# EAGLE design x-OSC Gloves_v6 (EAGLE 6.4)
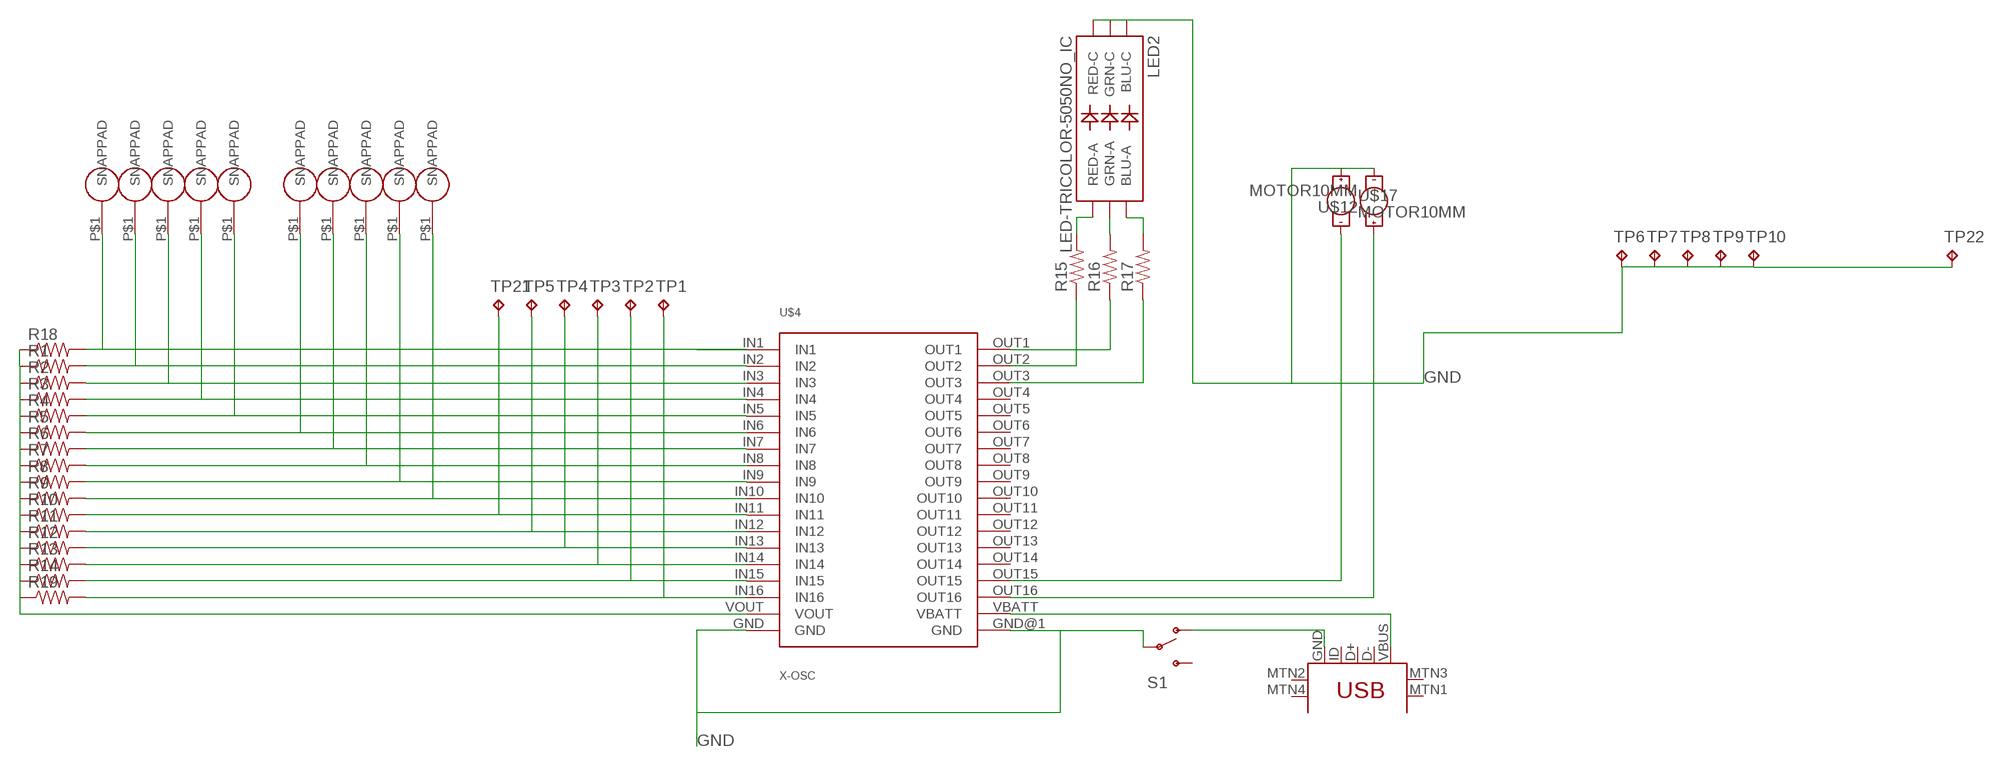
[diagram p0: schematic, sheet 1]

## Parts
LED2  LED-TRICOLOR-5050NO_IC  [LED-TRICOLOR-5050]
R1  RESISTOR0805-RES  [0805]
R2  RESISTOR0805-RES  [0805]
R3  RESISTOR0805-RES  [0805]
R4  RESISTOR0805-RES  [0805]
R5  RESISTOR0805-RES  [0805]
R6  RESISTOR0805-RES  [0805]
R7  RESISTOR0805-RES  [0805]
R8  RESISTOR0805-RES  [0805]
R9  RESISTOR0805-RES  [0805]
R10  RESISTOR0805-RES  [0805]
R11  RESISTOR0805-RES  [0805]
R12  RESISTOR0805-RES  [0805]
R13  RESISTOR0805-RES  [0805]
R14  RESISTOR0805-RES  [0805]
R15  RESISTOR0805-RES  [0805]
R16  RESISTOR0805-RES  [0805]
R17  RESISTOR0805-RES  [0805]
R18  RESISTOR0805-RES  [0805]
R19  RESISTOR0805-RES  [0805]
S1  SWITCH-SPDT-SMD-A  [SWITCH-SPST-SMD-A]
TP1  TPTP20R  [TP20R]
TP2  TPTP20R  [TP20R]
TP3  TPTP20R  [TP20R]
TP4  TPTP20R  [TP20R]
TP5  TPTP20R  [TP20R]
TP6  TPTP20R  [TP20R]
TP7  TPTP20R  [TP20R]
TP8  TPTP20R  [TP20R]
TP9  TPTP20R  [TP20R]
TP10  TPTP20R  [TP20R]
TP21  TPTP20R  [TP20R]
TP22  TPTP20R  [TP20R]
U$1  SNAP-PAD_7MM_ROUND  [SNAP-PAD_7MM_RD]
U$2  SNAP-PAD_7MM_ROUND  [SNAP-PAD_7MM_RD]
U$3  SNAP-PAD_7MM_ROUND  [SNAP-PAD_7MM_RD]
U$4  X-OSC  [X-OSC_SMD]
U$5  USB-MINIB-5PIN  [USB-MINIB]
U$6  SNAP-PAD_7MM_ROUND  [SNAP-PAD_7MM_RD]
U$7  SNAP-PAD_7MM_ROUND  [SNAP-PAD_7MM_RD]
U$8  SNAP-PAD_7MM_ROUND  [SNAP-PAD_7MM_RD]
U$9  SNAP-PAD_7MM_ROUND  [SNAP-PAD_7MM_RD]
U$10  SNAP-PAD_7MM_ROUND  [SNAP-PAD_7MM_RD]
U$11  SNAP-PAD_7MM_ROUND  [SNAP-PAD_7MM_RD]
U$12  MOTOR10MM  [VIBE-MOTOR-10MM]
U$17  MOTOR10MM  [VIBE-MOTOR-10MM]
U$21  SNAP-PAD_7MM_ROUND  [SNAP-PAD_7MM_RD]

## Nets
GND: LED2.4(BLU-C) LED2.5(RED-C) LED2.6(GRN-C) S1.2(P) TP6.TP TP7.TP TP8.TP TP9.TP TP10.TP TP22.TP U$4.GND U$4.GND@1(GND) U$12.- U$17.+
N$1: LED2.1(GRN-A) R16.2
N$2: LED2.2(RED-A) R15.2
N$3: R15.1 U$4.OUT2
N$4: R1.2 U$1.P$1(SNAPPAD) U$4.IN2
N$5: R16.1 U$4.OUT1
N$6: R2.2 U$2.P$1(SNAPPAD) U$4.IN3
N$7: R3.2 U$3.P$1(SNAPPAD) U$4.IN4
N$8: R4.2 U$4.IN5 U$6.P$1(SNAPPAD)
N$9: R5.2 U$4.IN6 U$7.P$1(SNAPPAD)
N$12: R6.2 U$4.IN7 U$8.P$1(SNAPPAD)
N$13: R7.2 U$4.IN8 U$9.P$1(SNAPPAD)
N$14: R8.2 U$4.IN9 U$10.P$1(SNAPPAD)
N$15: R9.2 U$4.IN10 U$11.P$1(SNAPPAD)
N$16: R10.2 TP21.TP U$4.IN11
N$17: LED2.3(BLU-A) R17.2
N$18: R11.2 TP5.TP U$4.IN12
N$19: R12.2 TP4.TP U$4.IN13
N$20: R13.2 TP3.TP U$4.IN14
N$21: R14.2 TP2.TP U$4.IN15
N$22: R19.2 TP1.TP U$4.IN16
N$23: U$4.OUT15 U$17.-
N$24: U$4.OUT16 U$12.+
N$25: R17.1 U$4.OUT3
N$26: S1.1(O) U$5.GND
N$33: U$4.VBATT U$5.VBUS
N$40: R18.2 U$4.IN1 U$21.P$1(SNAPPAD)
VDD: R1.1 R2.1 R3.1 R4.1 R5.1 R6.1 R7.1 R8.1 R9.1 R10.1 R11.1 R12.1 R13.1 R14.1 R18.1 R19.1 U$4.VOUT
Unconnected: S1.3(S) U$4.OUT4 U$4.OUT5 U$4.OUT6 U$4.OUT7 U$4.OUT8 U$4.OUT9 U$4.OUT10 U$4.OUT11 U$4.OUT12 U$4.OUT13 U$4.OUT14 U$5.D+ U$5.D- U$5.ID U$5.MTN1(MTN2) U$5.MTN2(MTN3) U$5.MTN3(MTN1) U$5.MTN4

## Library data of the parts
LED2 = SparkFun-LED:LED-TRICOLOR-5050
R1-R19 = SparkFun-Passives:RESISTOR: Resistor Basic schematic elements and footprints for 0603, 1206, and PTH resistors.
S1 = SparkFun-Electromechanical:SWITCH-SPDT: SPDT Switch Simple slide switch, Spark Fun Electronics SKU : COM-00102 DPDT SMT slide switch, AYZ0202, SWCH-08179
TP1-TP10 TP21 TP22 = testpad:TP: Test pad
U$1-U$3 U$6-U$11 U$21 = hannahsEagleLib:SNAP-PAD_7MM_ROUND
U$4 = x-io:X-OSC: 2x "TSM-118-04-F-SV" See: http://www.toby.co.uk/content/catalogue/products.aspx?series=TSM-1xx-xx-SV
U$5 = SparkFun-Connectors:USB-MINIB: Mini-USB "B" connector with 5th pin broken out. Created new symbol breaking out 5th "ID" pin in mini/micro USB connector spec. See: http://en.wikipedia.org/wiki/Mini_usb#Cables. Uses same footprint as 4-pin symbol. Also added pins to connect to mounting / shield pads if required (probably not generally needed as signals aren't shielded once they leave the connector).
U$12 U$17 = SparkFun-Electromechanical:MOTOR: Vibration Motor- ROB-08449 Physical dimension and wire connections for this powerful vibration motor. Motor has a self adhesive backing.

## Board
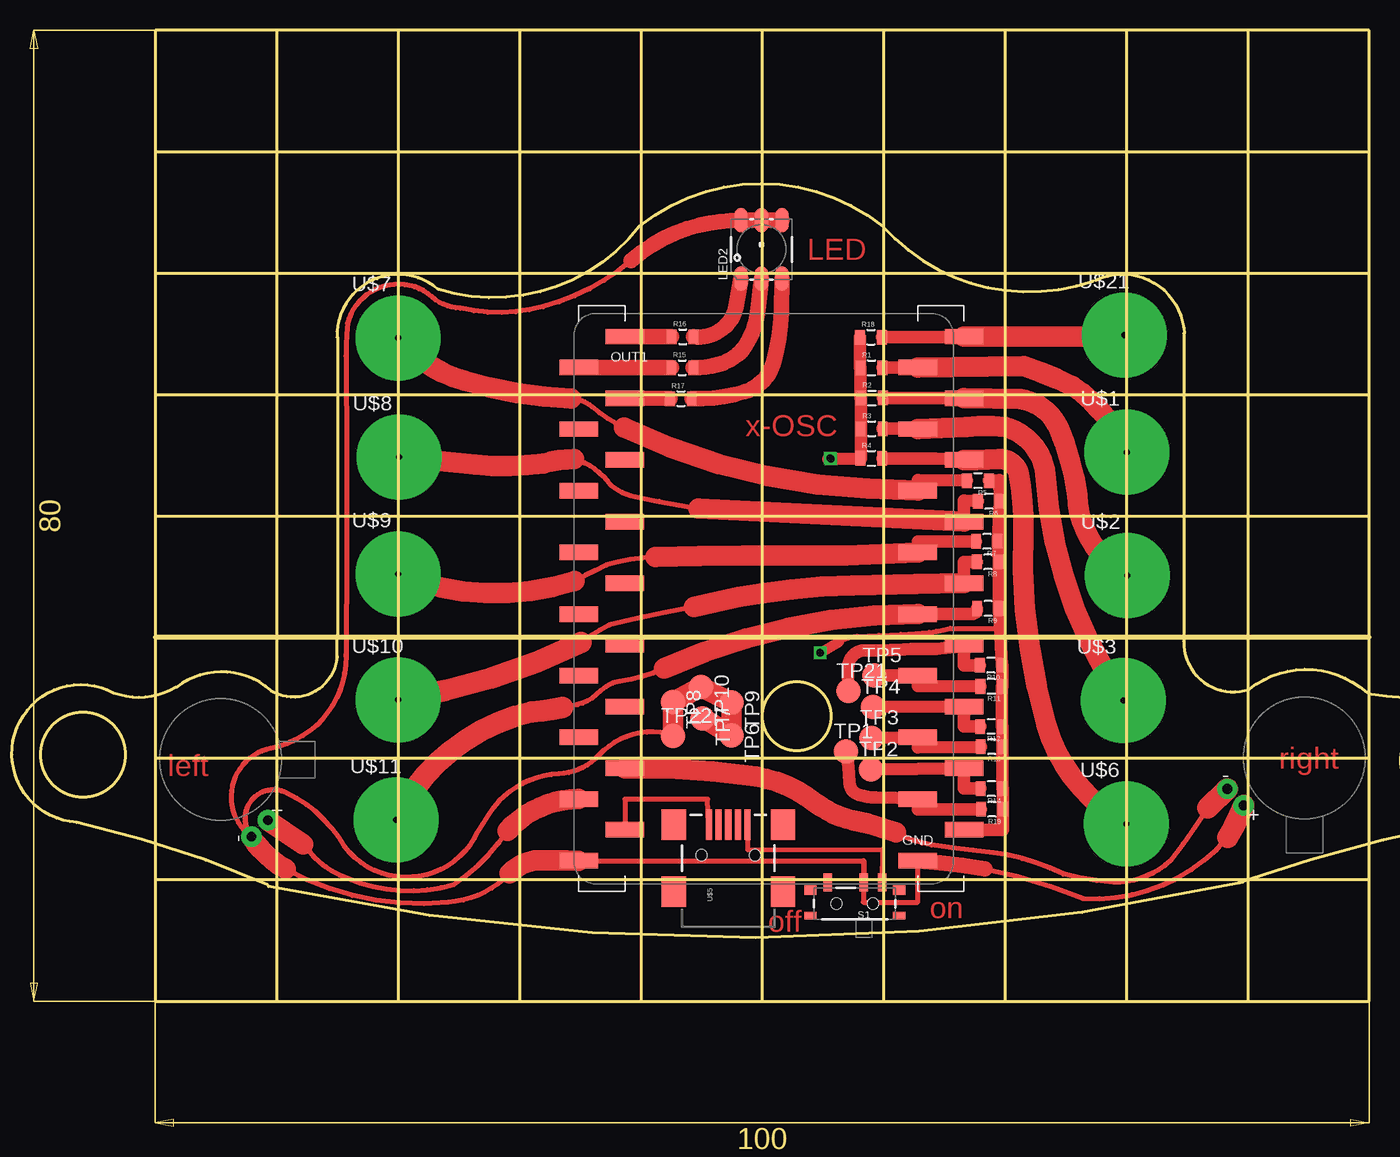
[diagram p1: board, top side]
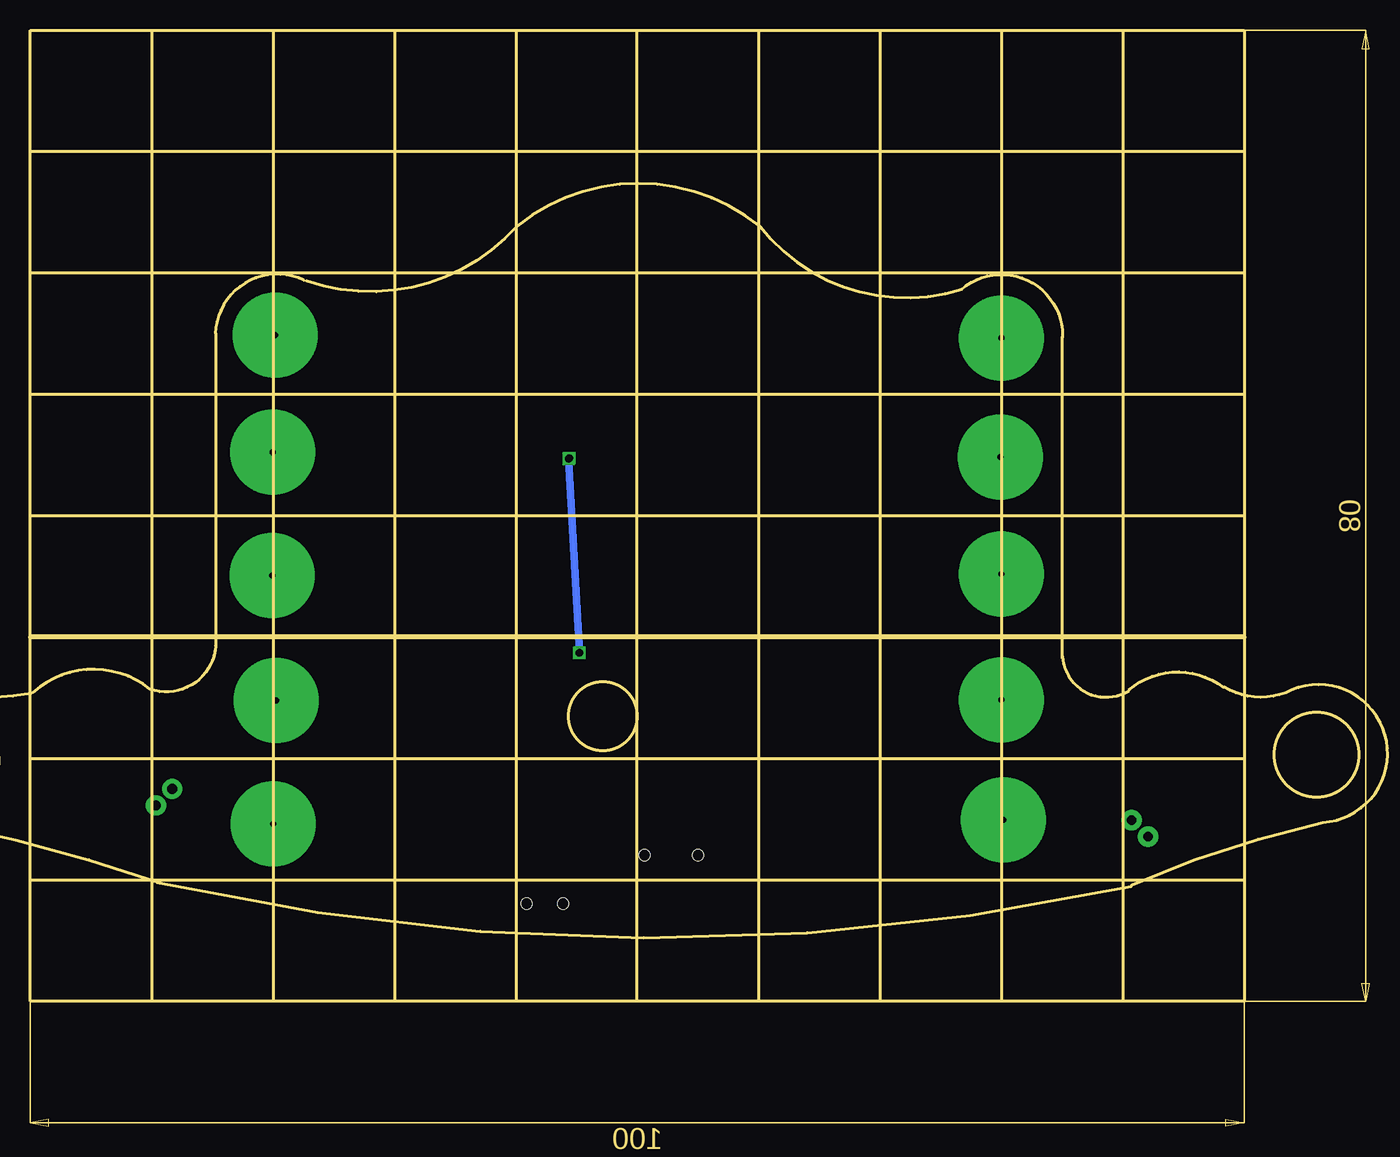
[diagram p2: board, bottom side, seen from below]

Size 100 x 80 mm. Coordinates in mm from the lower left corner, seen from the top.
Outline: 50,0 50,80
Outline: 40,80 40,0
Outline: 30,80 30,0
Outline: 20,80 20,0
Outline: 10,80 10,0
Outline: 0,70 0,80 60,80
Outline: 0,70 0,60
Outline: 0,60 0,50
Outline: 0,50 0,40
Outline: 0,40 0,30
Outline: 0,30 0,20
Outline: 0,20 0,10
Outline: 0,10 0,0 60,0
Outline: 60,0 70,0
Outline: 70,0 80,0
Outline: 80,0 90,0
Outline: 90,0 100,0 100,10
Outline: 100,10 100,20
Outline: 100,20 100,30
Outline: 100,30 100,40
Outline: 100,40 100,50
Outline: 100,50 100,60
Outline: 100,60 100,70
Outline: 100,70 100,80 90,80
Outline: 90,80 80,80
Outline: 80,80 70,80
Outline: 70,80 60,80
Outline: 60,80 60,0
Outline: 70,80 70,0
Outline: 80,80 80,0
Outline: 90,80 90,0
Outline: 100,10 0,10
Outline: 0,60 100,60
Outline: 0,50 100,50
Outline: 0,40 100,40
Outline: 0,30 100,30
Outline: 100,20 0,20
Outline: 0,70 100,70
Copper layers (1*16): Top 0.035mm / dielectric 1.5mm / Bottom 0.035mm
Design rules "default": minimum track width 10mil, minimum drill 24mil, track to track 8mil, track to pad 8mil, pad to pad 8mil, via to via 8mil, smd to smd 8mil, copper to edge 40mil, drill to drill 8mil, minimum pad ring 10mil, minimum via ring 8mil, stop-mask expansion 4mil, vias tented up to drill 0mil, thermal gap 10mil
Milling: area -9.5,16.8 to -2.5,23.8; area 102.6,16.3 to 109.6,23.3; area 50,20.7 to 55.6,26.3; 20 lines

### Footprints (pad centres in the part's own frame; a part is rotated, then mirrored left to right if it is on the bottom)
LED-TRICOLOR-5050 = smd 2 x 1.1: 1 -2.4,1.7; 2 -2.4,0; 3 -2.4,-1.7; 4 2.4,-1.7; 5 2.4,0; 6 2.4,1.7
0805 = smd 0.8 x 1.2: 1 -0.9,0; 2 0.9,0
SWITCH-SPST-SMD-A = smd 0.7 x 1.5: 1 -2.25,-1.75; 2 -0.75,-1.75; 3 2.25,-1.75 | smd 1 x 0.6: GND1 -3.65,1; GND3 3.65,1 | smd 1 x 0.8: GND2 -3.65,-1.1; GND4 3.65,-1.1 | hole 0.9: -1.5,0; 1.5,0
TP20R = smd 2 x 2: TP 0,0
SNAP-PAD_7MM_RD = drill 0.5 pad 7: P$1 0,0
X-OSC_SMD = smd 3.17 x 1.27: GND 12.7,-21.59; GND@1 -15.24,-21.59; IN1 16.51,21.59; IN2 12.7,19.05; IN3 16.51,16.51; IN4 12.7,13.97; IN5 16.51,11.43; IN6 12.7,8.89; IN7 16.51,6.35; IN8 12.7,3.81; IN9 16.51,1.27; IN10 12.7,-1.27; IN11 16.51,-3.81; IN12 12.7,-6.35; IN13 16.51,-8.89; IN14 12.7,-11.43; IN15 16.51,-13.97; IN16 12.7,-16.51; OUT1 -11.43,21.59; OUT2 -15.24,19.05; OUT3 -11.43,16.51; OUT4 -15.24,13.97; OUT5 -11.43,11.43; OUT6 -15.24,8.89; OUT7 -11.43,6.35; OUT8 -15.24,3.81; OUT9 -11.43,1.27; OUT10 -15.24,-1.27; OUT11 -11.43,-3.81; OUT12 -15.24,-6.35; OUT13 -11.43,-8.89; OUT14 -15.24,-11.43; OUT15 -11.43,-13.97; OUT16 -15.24,-16.51; VBATT -11.43,-19.05; VOUT 16.51,-19.05
USB-MINIB = smd 2.5 x 0.5: D+ 2.5,0; D- 2.5,0.8; GND 2.5,-1.6; ID 2.5,-0.8; VBUS 2.5,1.6 | smd 2.5 x 2: MTN1 -3,4.5; MTN2 2.5,4.5; MTN3 -3,-4.5; MTN4 2.5,-4.5 | hole 0.9: 0,2.2; 0,-2.2
VIBE-MOTOR-10MM = drill 0.8 pad 1.676: + -5,-3.9; - -6.35,-2.54

### Placement (x,y rotation side)
LED2  49.94,61.96 90 top
R1  59.01,52.19 0 top
R2  59.04,49.71 0 top
R3  59.01,47.17 0 top
R4  58.99,44.74 0 top
R5  67.76,42.89 180 top
R6  68.67,41.2 180 top
R7  68.52,37.89 180 top
R8  68.58,36.2 180 top
R9  68.6,32.36 180 top
R10  68.83,27.69 180 top
R11  68.88,25.94 180 top
R12  68.85,22.64 180 top
R13  68.9,20.96 180 top
R14  68.89,17.52 180 top
R15  43.41,52.21 0 top
R16  43.44,54.76 0 top
R17  43.3,49.65 0 top
R18  58.96,54.72 0 top
R19  68.92,15.82 180 top
S1  57.63,8.05 180 top
TP1  56.88,20.59 0 top
TP2  58.96,19.12 0 top
TP3  59.01,21.71 0 top
TP4  59.13,24.25 0 top
TP5  59.24,26.85 0 top
TP6  47.46,21.92 270 top
TP7  45.06,23.3 270 top
TP8  42.65,24.68 270 top
TP9  47.48,24.62 270 top
TP10  44.97,25.91 270 top
TP21  57.09,25.56 0 top
TP22  42.64,21.87 0 top
U$1  80.03,45.24 0 top
U$2  80.07,35.08 0 top
U$3  79.74,24.79 0 top
U$4  50.12,33.18 0 top
U$5  47.2,12.05 90 top
U$6  80,14.62 0 top
U$7  19.99,54.66 0 top
U$8  20.07,44.84 0 top
U$9  20.01,35.2 0 top
U$10  19.99,24.85 0 top
U$11  19.85,14.95 0 top
U$12  5.37,19.92 90 top
U$17  94.66,20.04 0 top
U$21  79.84,54.9 0 top

### Tracks (layer width: path | path; a pad name or v marks a point on that pad's centre or on a via)
GND
  Top 0.406: 68.34,10.92 arc-11 76.44,8.47 arc53 88.36,13.5 | U$4.GND@1 58.37,11.58 | 58.37,11.58 S1.2 | 58.37,11.58 58.33,11.58 58.33,8.15 62.82,8.15 U$4.GND | 39.18,61.03 arc-26 31.94,57.23 arc-28 25.13,57.1 arc-28 23.08,57.79 arc120 15.83,55.87 arc5 15.71,53.17 arc-1 15.71,28.62 arc1 15.71,28.44 arc-80 9.53,20.84 arc133 U$12.- arc-156 10.83,17.16 arc-35 15.59,12.76 arc118 26.55,13.98 arc-4 27.88,15.99 arc-49 33.24,18.75 arc45 36.53,20.27 arc-64 42.7,21.93 | TP22.TP 42.7,21.93 | 42.7,21.93 42.65,21.93 | 29.19,10.53 arc-42 24.12,8.17 arc-35 10.72,10.91
  Top 1.27: U$4.GND arc-4 68.34,10.92 | LED2.4 LED2.5 LED2.6 arc14 44.83,63.94 arc27 39.18,61.03
  Top 1.676: 10.72,10.91 arc-28 U$12.- | 42.65,21.93 TP8.TP TP10.TP TP9.TP TP6.TP 45.14,23.36 TP7.TP | U$4.GND@1 arc-2 31.84,11.63 arc48 29.19,10.53
  Top 1.778: 88.36,13.5 arc10 U$17.+
N$1
  Top 1.27: LED2.1 47.84,57.24 arc-33 47.13,55.79 arc-55 R16.2
N$2
  Top 1.27: LED2.2 49.7,57.31 arc-19 48.96,54.6 arc-45 46.79,52.6 arc-22 R15.2
N$3
  Top 1.27: U$4.OUT2 R15.1
N$4
  Top 1.016: R1.2 62.82,52.19 U$4.IN2
  Top 1.676: U$4.IN2 71.54,52.32 arc-10 75.55,50.7 arc-33 U$1.P$1
N$5
  Top 1.27: U$4.OUT1 R16.1
N$6
  Top 1.016: R2.2 66.63,49.71 U$4.IN3
  Top 1.676: U$4.IN3 71.28,49.63 arc-54 74.41,47.31 arc-14 75.95,41.71 arc59 U$2.P$1
N$7
  Top 1.016: R3.2 62.82,47.17 U$4.IN4
  Top 1.676: U$4.IN4 66.78,47.33 arc-11 70.02,47.3 arc-69 73.33,43.42 arc31 U$3.P$1
N$8
  Top 1.016: R4.2 64.28,44.74 U$4.IN5
  Top 1.676: U$4.IN5 arc5 69.5,44.7 arc-73 71.1,43.59 arc-14 71.5,38.76 arc18 73.42,22.78 arc46 U$6.P$1
N$9
  Top 0.406: 38.6,47.27 arc-15 35.97,48.99 arc38 34.25,49.66
  Top 1.016: U$4.IN6 62.82,42.95 R5.2
  Top 1.676: U$4.IN6 58.7,42.24 arc-23 38.6,47.27 | 34.25,49.66 arc-14 25.43,51.13 arc-33 U$7.P$1
N$12
  Top 0.406: 34.51,44.7 arc-39 37.5,42.54 arc32 39.9,41.51 arc2 44.74,40.59
  Top 1.016: U$4.IN7 66.63,41.25 R6.2
  Top 1.676: U$8.P$1 26.36,44.2 arc14 31.99,44.33 arc-13 34.51,44.7 | U$4.IN7 44.74,40.59
N$13
  Top 0.406: 41.19,36.6 arc16 37.14,35.93 arc0 34.52,34.65
  Top 1.016: U$4.IN8 62.82,37.89 R7.2
  Top 1.676: U$4.IN8 56.88,36.73 52.1,36.73 arc1 41.19,36.6 | 34.52,34.65 arc-41 U$9.P$1
N$14
  Top 0.406: 44.38,32.49 arc4 37.38,31.01 arc9 35.08,29.58
  Top 1.016: U$4.IN9 66.63,36.2 R8.2
  Top 1.676: U$4.IN9 62.66,34.38 arc0 57.45,34.27 arc8 49.89,33.61 arc5 44.38,32.49
  Top 1.778: 35.08,29.58 arc-18 U$10.P$1
N$15
  Top 0.406: 41.92,27.41 arc-17 38.25,26.36 arc28 37.14,25.93 arc10 35.98,24.95 arc-27 33.53,24.22
  Top 1.016: U$4.IN10 67.24,31.91 arc90 R9.2
  Top 1.676: U$4.IN10 arc24 41.92,27.41
  Top 1.778: 33.53,24.22 arc-8 31.01,23.85 arc52 U$11.P$1
N$16
  Top 1.016: U$4.IN11 | TP21.TP 57.06,27.4 arc-32 57.3,28.27 arc-60 58.46,28.91 arc5 61.66,29 arc-5 63.54,29.04 arc15 U$4.IN11 | R10.2 66.63,27.69 U$4.IN11
N$17
  Top 1.27: LED2.3 51.56,56.84 arc-14 50.92,52.6 arc-58 48.58,50.23 arc-18 R17.2
N$18
  Top 1.016: R11.2 62.82,25.97 U$4.IN12 TP5.TP
N$19
  Top 1.016: TP4.TP U$4.IN13 66.63,22.64 R12.2
N$20
  Top 1.016: R13.2 62.82,20.93 U$4.IN14 TP3.TP
N$21
  Top 1.016: TP2.TP U$4.IN15 66.63,17.52 R14.2
N$22
  Top 1.016: R19.2 62.82,15.82 U$4.IN16 62.82,16.72 59.34,16.8 arc-14 57.98,17 arc-74 57.18,18.04 arc13 TP1.TP
N$23
  Top 0.406: 86.69,15.94 arc-7 83.61,11.56 arc-45 78.92,9.81 arc-10 74.79,10.49 arc19 69.07,12.24 arc-2 63.95,12.87 arc-17 61.01,13.9
  Top 1.676: 61.01,13.9 arc8 57.46,14.93 arc-25 54.44,16.32 arc27 49.47,18.54 arc9 U$4.OUT15
  Top 1.778: U$17.- 86.69,15.94
N$24
  Top 0.406: 12.19,12.94 arc34 15.78,10.15 arc39 24.61,9.63 arc21 29.03,14.04
  Top 1.676: U$12.+ 12.19,12.94 | 29.03,14.04 arc-48 U$4.OUT16
N$25
  Top 1.27: U$4.OUT3 R17.1
N$26
  Top 0.406: U$5.GND 48.78,12.5 59.91,12.53 S1.1
N$33
  Top 0.406: U$5.VBUS 45.59,14.58 45.5,16.64 38.69,16.64 U$4.VBATT
N$40
  Top 0.406: 79.84,54.77 U$21.P$1
  Top 1.016: R18.2 66.63,54.72 U$4.IN1
  Top 1.676: U$4.IN1 79.84,54.77
N$51  (via drill 0.6)
  other vias: 55.59,44.76
N$52  (via drill 0.6)
  other vias: 54.79,28.69
VDD  (via drill 0.6)
  Top 0.406: 56.35,29.64 arc-27 57.81,30.06 arc1 63.19,30.35 arc13 65.46,30.74 69.57,30.74
  Top 0.61: 55.47,44.7 v55.65,44.7 | 69.57,30.74 69.57,30.96
  Top 0.813: R4.1 58.11,44.74 | R3.1 58.14,47.17 | R2.1 58.1,49.71 | R1.1 58.05,52.19 | v54.76,28.72 56.35,29.64
  Top 1.016: R3.1 58.11,44.74 55.47,44.7 | 58.14,47.17 R2.1 | 58.1,49.71 R1.1 | 58.05,52.19 R18.1 | U$4.VOUT 69.82,14.13 R19.1 69.82,17.52 R14.1 69.79,20.96 R13.1 69.8,22.64 R12.1 69.75,25.94 R11.1 69.78,27.69 R10.1 69.57,30.96 R9.1 R8.1 R7.1 R6.1 69.52,42.95 R5.1
  Bottom 0.61: v55.65,44.7 v54.76,28.72

### Text on the board
Top: LED | x-OSC | left | right | on | off
_tsilk: RGB | LED | Left | Right | vibration | vibration | motor | motor | x-OSC